# EAGLE design TTS (EAGLE 7.5.0)
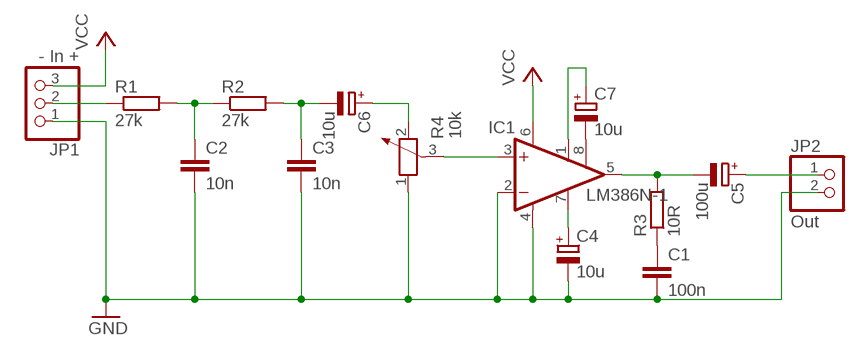
[diagram p0: schematic, sheet 1]

## Parts
C1  100n  C-EU050-024X044  [C050-024X044]
C2  10n  C-EU050-024X044  [C050-024X044]
C3  10n  C-EU050-024X044  [C050-024X044]
C4  10u  CPOL-EUE2.5-5  [E2,5-5]
C5  100u  CPOL-EUE2.5-6  [E2,5-6]
C6  10u  CPOL-EUE2.5-5  [E2,5-5]
C7  10u  CPOL-EUE2.5-5  [E2,5-5]
IC1  LM386N-1  [DIL08]
JP1  - In +  PINHD-1X3  [1X03]
JP2  Out  PINHD-1X2  [1X02]
R1  27k  R-EU_0207/10  [0207/10]
R2  27k  R-EU_0207/10  [0207/10]
R3  10R  R-EU_0207/10  [0207/10]
R4  10k  POTENTIOMETER_PT-10S  [PT-10S]

## Nets
GND: C1.2 C2.2 C3.2 C4.- IC1.2(-IN) IC1.4(GND) JP1.1 JP2.2 R4.1
N$1: C1.1 R3.1
N$2: C2.1 R1.2 R2.1
N$3: C3.1 C6.- R2.2
N$4: C4.+ IC1.7(BYPASS)
N$5: C5.- IC1.5(OUT) R3.2
N$6: IC1.3(+IN) R4.3
N$7: JP1.2 R1.1
N$8: C5.+ JP2.1
N$9: C6.+ R4.2
N$10: C7.- IC1.8(GAIN)
N$11: C7.+ IC1.1(GAIN)
VCC: IC1.6(VS) JP1.3

## Library data of the parts
C1 = resistor:C-EU: CAPACITOR, European symbol
C2 C3 = rcl:C-EU: CAPACITOR, European symbol
C4-C7 = rcl:CPOL-EU: POLARIZED CAPACITOR, European symbol
IC1 = linear:LM386?-*: Low Voltage Audio Power Amplifier Source: http://cache.national.com/ds/LM/LM386.pdf
JP1 = pinhead:PINHD-1X3: PIN HEADER
JP2 = pinhead:PINHD-1X2: PIN HEADER
R1-R3 = resistor:R-EU_: RESISTOR, European symbol
R4 = rcl:POTENTIOMETER_: Potentiometer

## Board
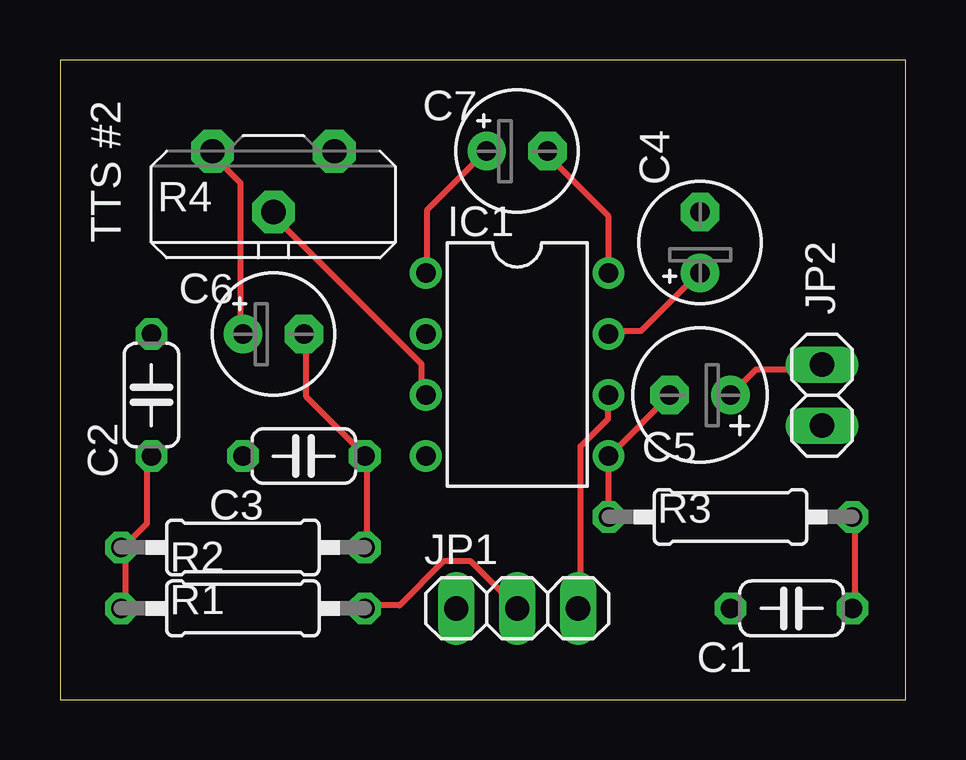
[diagram p1: board, top side]
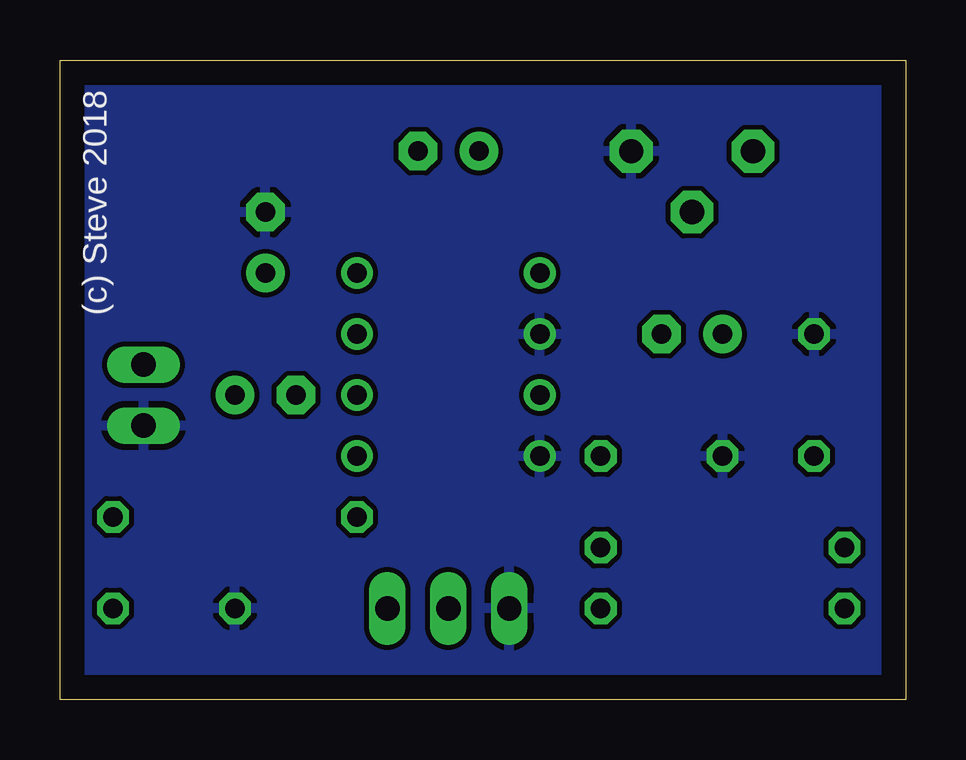
[diagram p2: board, bottom side, seen from below]

Size 35.23 x 26.66 mm. Coordinates in mm from the lower left corner, seen from the top.
Outline: 0,0 35.23,0 35.23,26.66 0,26.66 0,0
Copper layers (1*16): Top 0.035mm / dielectric 1.5mm / Bottom 0.035mm
Design rules "default": minimum track width 10mil, minimum drill 24mil, track to track 8mil, track to pad 8mil, pad to pad 8mil, via to via 8mil, smd to smd 8mil, copper to edge 40mil, drill to drill 8mil, minimum pad ring 10mil, minimum via ring 8mil, stop-mask expansion 4mil, vias tented up to drill 0mil, thermal gap 10mil

### Footprints (pad centres in the part's own frame; a part is rotated, then mirrored left to right if it is on the bottom)
C050-024X044 = drill 0.813 octagon: 1 -2.54,0; 2 2.54,0
E2,5-5 = drill 0.813 pad 1.6: + -1.27,0 | drill 0.813 pad 1.6 octagon: - 1.27,0
E2,5-6 = drill 0.813 pad 1.6: + -1.27,0 | drill 0.813 pad 1.6 octagon: - 1.27,0
DIL08 = drill 0.813 pad 1.27: 1 -3.81,-3.81; 2 -1.27,-3.81; 3 1.27,-3.81; 4 3.81,-3.81; 5 3.81,3.81; 6 1.27,3.81; 7 -1.27,3.81; 8 -3.81,3.81
1X03 = drill 1.016 long: 1 -2.54,0; 2 0,0; 3 2.54,0
1X02 = drill 1.016 long: 1 -1.27,0; 2 1.27,0
0207/10 = drill 0.813 octagon: 1 -5.08,0; 2 5.08,0
PT-10S = drill 1.016 pad 1.778 octagon: 1 -2.54,-1.27; 2 2.54,-1.27; 3 0,1.27

### Placement (x,y rotation side)
C1  30.48,3.81 180 top
C2  3.81,12.7 90 top
C3  10.16,10.16 180 top
C4  26.67,19.05 90 top
C5  26.67,12.7 180 top
C6  8.89,15.24 0 top
C7  19.05,22.86 0 top
IC1  19.05,13.97 270 top
JP1  19.05,3.81 0 top
JP2  31.75,12.7 270 top
R1  7.62,3.81 180 top
R2  7.62,6.35 0 top
R3  27.94,7.62 180 top
R4  8.89,21.59 180 top

### Tracks (layer width: path | path; a pad name or v marks a point on that pad's centre or on a via)
GND
  pour Bottom: 0,26.67 0,0 35.56,0 35.56,26.67
N$1
  Top 0.254: C1.1 33.12,3.94 33.12,7.59 R3.1
N$2
  Top 0.254: R1.2 2.72,3.94 2.72,6.22 R2.1 2.72,6.45 3.63,7.37 3.63,10.11 C2.1
N$3
  Top 0.254: R2.2 12.78,6.45 12.78,10.11 C3.1 12.55,10.34 10.26,12.62 10.26,15.14 C6.-
N$4
  Top 0.254: IC1.7 23.06,15.37 24.21,15.37 26.49,17.65 C4.+
N$5
  Top 0.254: R3.2 22.84,7.82 22.84,10.11 IC1.5 23.06,10.34 25.35,12.62 C5.-
N$6
  Top 0.254: IC1.3 15.06,12.85 15.06,13.99 8.89,20.17 R4.3
N$7
  Top 0.254: R1.1 12.78,3.94 14.15,3.94 15.98,5.77 17.12,5.77 18.95,3.94 JP1.2
N$8
  Top 0.254: C5.+ 29.01,13.77 31.75,13.77 JP2.1
N$9
  Top 0.254: C6.+ 7.52,15.37 7.52,21.54 6.38,22.68 R4.2
N$10
  Top 0.254: IC1.8 22.84,17.88 22.84,20.17 20.32,22.68 C7.-
N$11
  Top 0.254: IC1.1 15.29,17.88 15.29,20.4 17.58,22.68 C7.+
VCC
  Top 0.254: IC1.6 22.84,12.62 22.84,11.71 21.69,10.57 21.69,3.94 JP1.3

### Text on the board
tPlace: TTS #2
bPlace: (c) Steve 2018